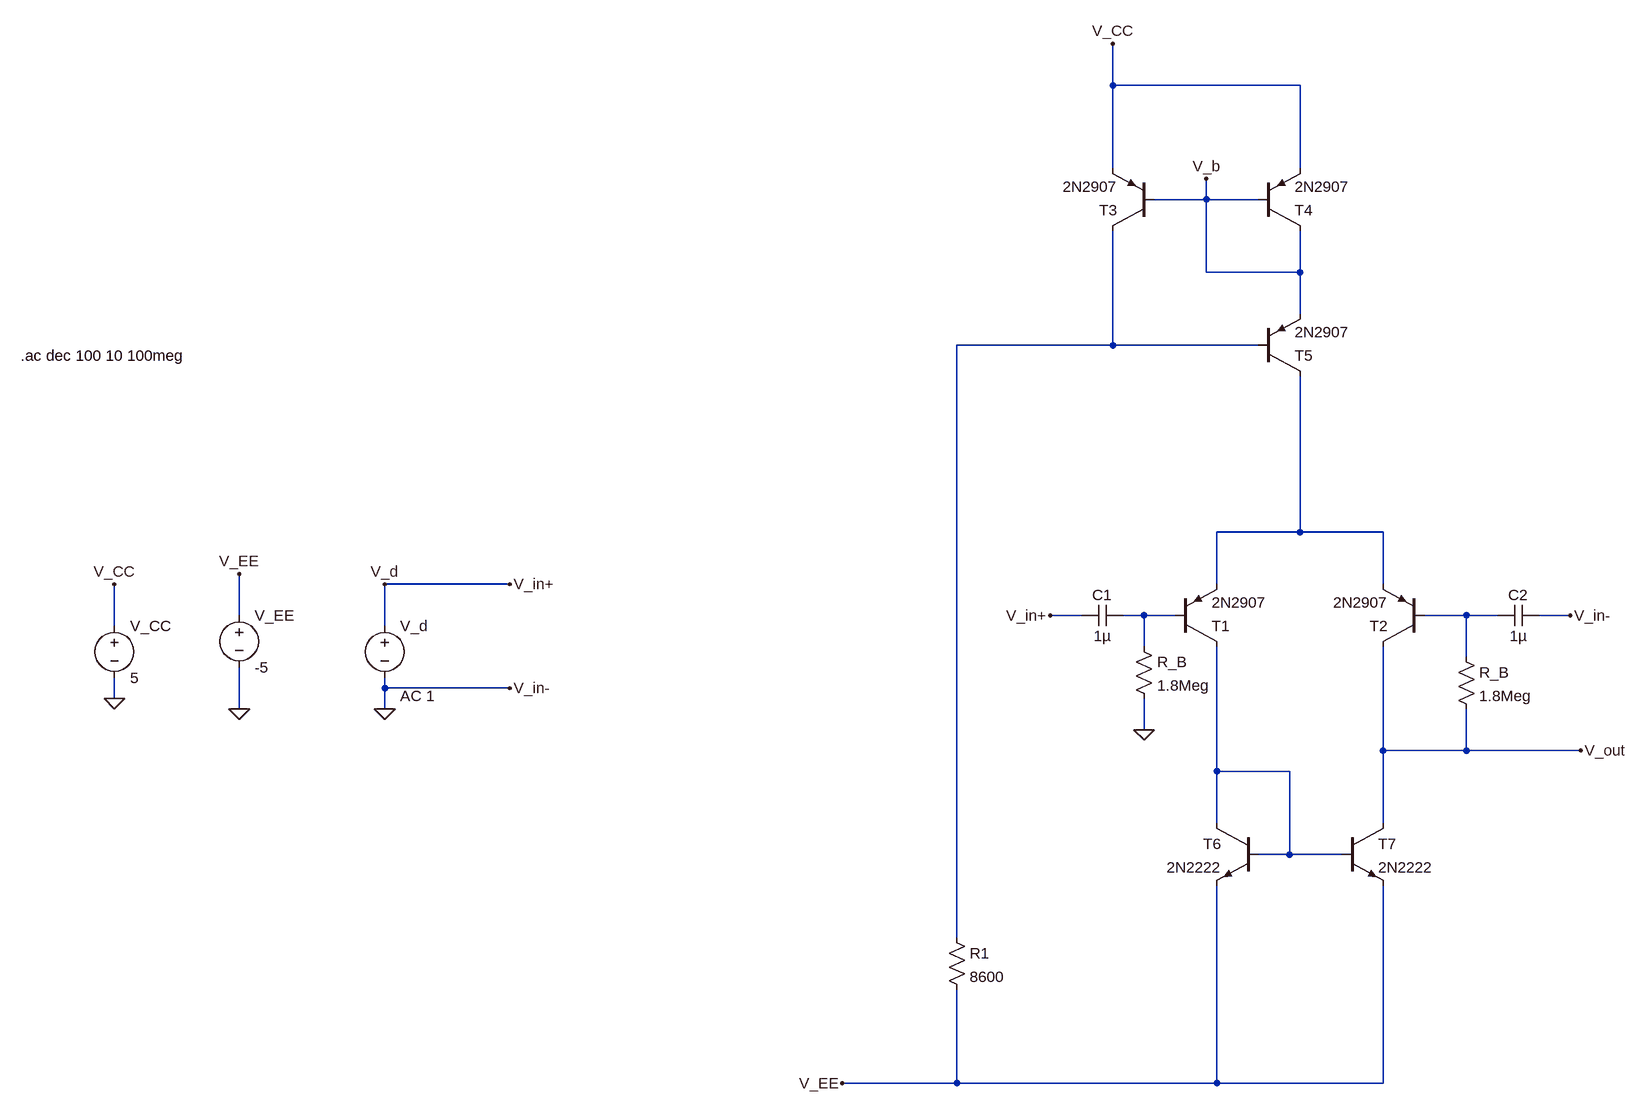
[diagram p0: schematic differential_amplifier_long_tailed_pair.asc]
differential_amplifier_long_tailed_pair.asc, the LTspice schematic file:
Version 4
SHEET 1 1428 1148
WIRE 160 -448 160 -512
WIRE 448 -448 160 -448
WIRE 160 -320 160 -448
WIRE 448 -320 448 -448
WIRE 304 -272 304 -304
WIRE 304 -272 224 -272
WIRE 384 -272 304 -272
WIRE 304 -160 304 -272
WIRE 448 -160 448 -224
WIRE 448 -160 304 -160
WIRE 448 -96 448 -160
WIRE 160 -48 160 -224
WIRE 160 -48 -80 -48
WIRE 384 -48 160 -48
WIRE 448 240 448 0
WIRE 448 240 320 240
WIRE 576 240 448 240
WIRE -768 320 -960 320
WIRE 320 320 320 240
WIRE 576 320 576 240
WIRE -1184 368 -1184 304
WIRE 112 368 64 368
WIRE 208 368 176 368
WIRE 256 368 208 368
WIRE 704 368 640 368
WIRE 752 368 704 368
WIRE 864 368 816 368
WIRE -1376 384 -1376 320
WIRE -960 384 -960 320
WIRE 208 416 208 368
WIRE 704 432 704 368
WIRE -960 480 -960 464
WIRE -768 480 -960 480
WIRE -1376 496 -1376 464
WIRE -1184 512 -1184 448
WIRE -960 512 -960 480
WIRE 208 544 208 496
WIRE 576 576 576 416
WIRE 704 576 704 512
WIRE 704 576 576 576
WIRE 880 576 704 576
WIRE 320 608 320 416
WIRE 432 608 320 608
WIRE 320 688 320 608
WIRE 576 688 576 576
WIRE 432 736 432 608
WIRE 432 736 384 736
WIRE 512 736 432 736
WIRE -80 864 -80 -48
WIRE -80 1088 -80 944
WIRE -80 1088 -256 1088
WIRE 320 1088 320 784
WIRE 320 1088 -80 1088
WIRE 576 1088 576 784
WIRE 576 1088 320 1088
FLAG -1376 496 0
FLAG -1184 512 0
FLAG -960 512 0
FLAG 160 -512 V_CC
FLAG 304 -304 V_b
FLAG -1376 320 V_CC
FLAG -1184 304 V_EE
FLAG -256 1088 V_EE
FLAG -960 320 V_d
FLAG 208 544 0
FLAG 64 368 V_in+
FLAG 864 368 V_in-
FLAG 880 576 V_out
FLAG -768 320 V_in+
FLAG -768 480 V_in-
SYMBOL voltage -1376 368 R0
WINDOW 123 0 0 Left 0
WINDOW 39 0 0 Left 0
SYMATTR InstName V_CC
SYMATTR Value 5
SYMBOL pnp 640 416 R180
SYMATTR InstName T2
SYMATTR Value 2N2907
SYMBOL pnp 256 416 M180
SYMATTR InstName T1
SYMATTR Value 2N2907
SYMBOL voltage -1184 352 R0
WINDOW 123 0 0 Left 0
WINDOW 39 0 0 Left 0
SYMATTR InstName V_EE
SYMATTR Value -5
SYMBOL voltage -960 368 R0
WINDOW 123 24 124 Left 2
WINDOW 39 0 0 Left 0
SYMATTR InstName V_d
SYMATTR Value ""
SYMATTR Value2 AC 1
SYMBOL pnp 224 -224 R180
SYMATTR InstName T3
SYMATTR Value 2N2907
SYMBOL pnp 384 -224 M180
SYMATTR InstName T4
SYMATTR Value 2N2907
SYMBOL pnp 384 0 M180
SYMATTR InstName T5
SYMATTR Value 2N2907
SYMBOL res -96 848 R0
SYMATTR InstName R1
SYMATTR Value 8600
SYMBOL npn 384 688 M0
SYMATTR InstName T6
SYMATTR Value 2N2222
SYMBOL npn 512 688 R0
SYMATTR InstName T7
SYMATTR Value 2N2222
SYMBOL cap 176 352 R90
WINDOW 0 0 32 VBottom 2
WINDOW 3 32 32 VTop 2
SYMATTR InstName C1
SYMATTR Value 1µ
SYMBOL cap 816 352 R90
WINDOW 0 0 32 VBottom 2
WINDOW 3 32 32 VTop 2
SYMATTR InstName C2
SYMATTR Value 1µ
SYMBOL res 192 400 R0
SYMATTR InstName R_B
SYMATTR Value 1.8Meg
SYMBOL res 688 416 R0
SYMATTR InstName R_B
SYMATTR Value 1.8Meg
TEXT -1520 -32 Left 2 !.ac dec 100 10 100meg

The netlist it stands for:
* differential_amplifier_long_tailed_pair.asc
V_CC V_CC 0 5
Q§T2 V_out N004 N002 0 2N2907
Q§T1 N005 N003 N002 0 2N2907
V_EE V_EE 0 -5
V_d V_in+ 0 AC 1
Q§T3 N001 V_b V_CC 0 2N2907
Q§T4 V_b V_b V_CC 0 2N2907
Q§T5 N002 N001 V_b 0 2N2907
R1 N001 V_EE 8600
Q§T6 N005 N005 V_EE 0 2N2222
Q§T7 V_out N005 V_EE 0 2N2222
C1 N003 V_in+ 1µ
C2 0 N004 1µ
R_B N003 0 1.8Meg
R_B N004 V_out 1.8Meg
.model NPN NPN
.model PNP PNP
.lib standard.bjt
.ac dec 100 10 100meg
.backanno
.end